# Altium project Inverter Processor.PrjPcb
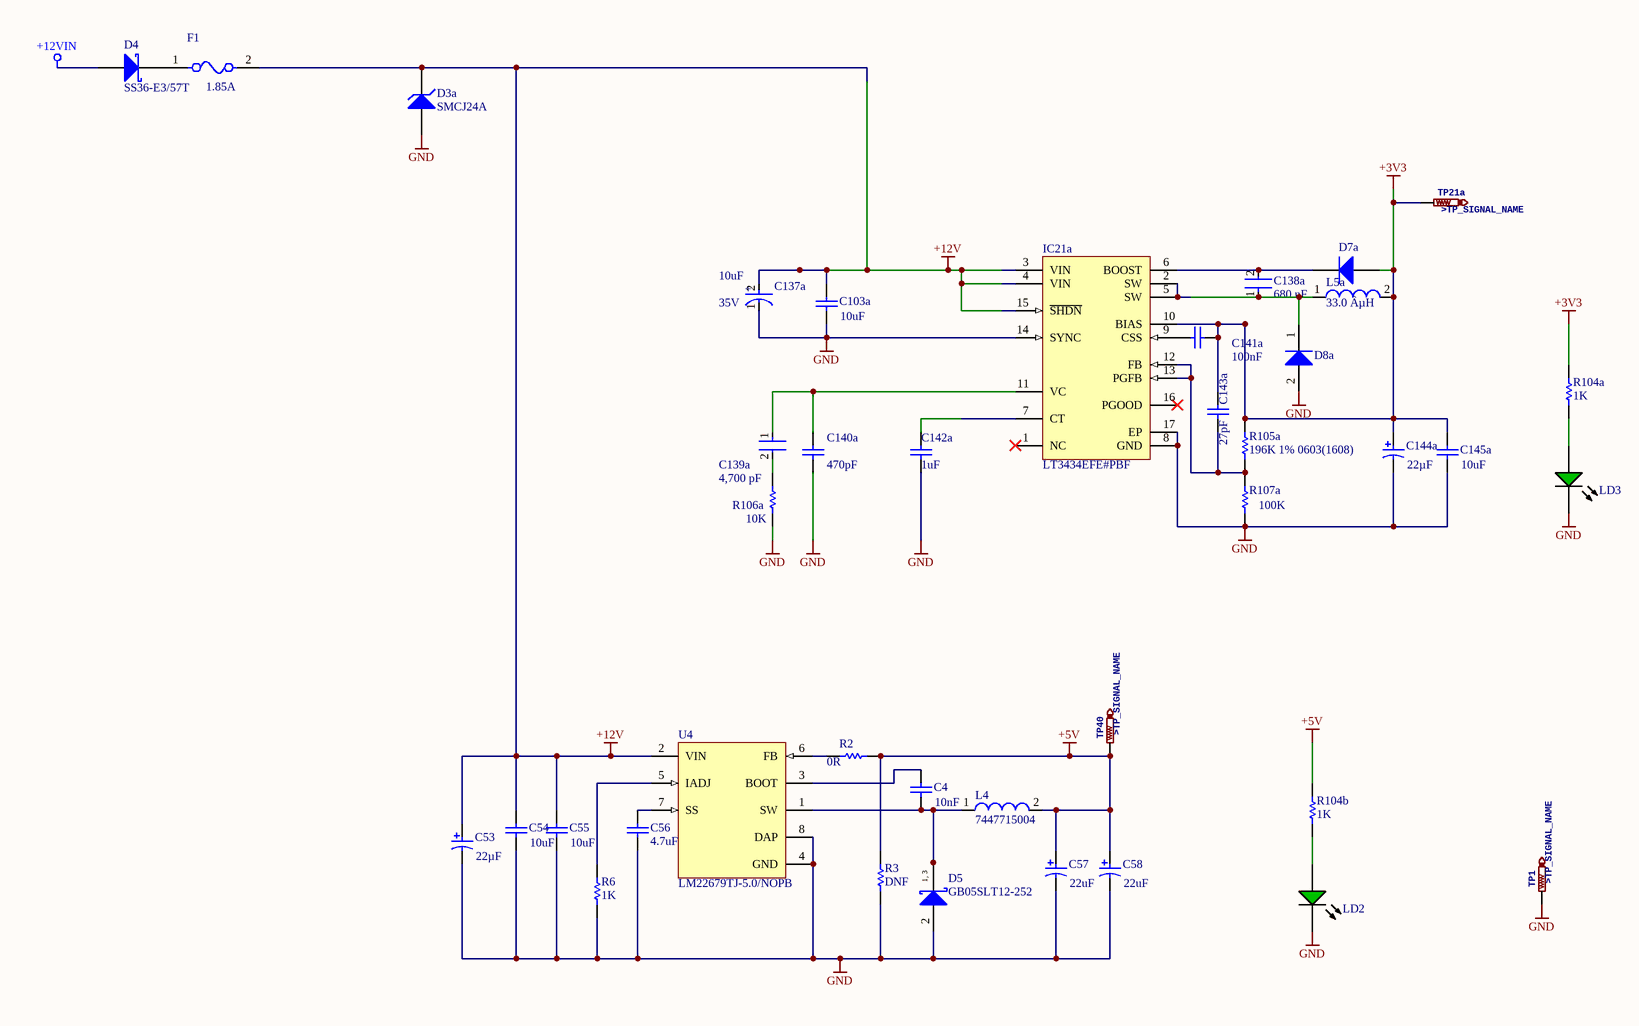
[diagram p0: Power.SchDoc]
1 sheet, 40 parts. Net scope: global (net labels, ports and power ports of the same name join across sheets).
Board file: Inverter Processor PCB.PcbDoc

## Sheet Power.SchDoc
size A3

### Parts
C4  value 10nF  [CAPC0805(2012)100_N]  (hidden comment: CAP 10nF 100V 0805(2012))
C53  Capacitance: 22µF  [CAPMP6032X28-T_V]  (hidden comment: TPSC226K025R0275)
C54  Capacitance: 10uF  [CAPC3225X280X20LL40]  (hidden comment: CGA6P3X7S1H106K250AB)
C55  Capacitance: 10uF  [CAPC3225X280X20LL40]  (hidden comment: CGA6P3X7S1H106K250AB)
C56  value 4.7uF  [CAPC1206(3216)190_M]  (hidden comment: CAP 4.7uF 25V 1206(3216))
C57  Capacitance: 22uF  [CAPMP7344X43-T_V]  (hidden comment: TPSE227M016R0100)
C58  Capacitance: 22uF  [CAPMP7344X43-T_V]  (hidden comment: TPSE227M016R0100)
C103a  Capacitance: 10uF  [CAPC3225X280X20LL40]  (hidden comment: CGA6P3X7S1H106K250AB)
C137a  value 10uF  Voltage Rating: 35V  [FP-TAJD-MFG]  (hidden comment: TAJD106M035RNJ)
C138a  value 680 nF  [FP-CC0603-DA-MFG]  (hidden comment: CC0603KRX7R7BB684)
C139a  value 4,700 pF  [FP-C0603C-CF-MFG]  (hidden comment: C0603C472G5GACTU)
C140a  value 470pF  [CAPC0603(1608)100_M]  (hidden comment: CAP 470pF 50V 0603(1608))
C141a  value 100nF  [CAPC0805(2012)100_L]  (hidden comment: CAP 100nF 16V 0805(2012))
C142a  value 1uF  [CAPC0805(2012)145_N]  (hidden comment: CAP 1uF 6.3V 0805(2012))
C143a  value 27pF  [CAPC0603(1608)100_L]  (hidden comment: CAP 27pF 50V 0603(1608))
C144a  Capacitance: 22µF  [CAPMP6032X28-T_V]  (hidden comment: TPSC226K025R0275)
C145a  Capacitance: 10uF  [CAPC3225X280X20LL40]  (hidden comment: CGA6P3X7S1H106K250AB)
D3a  SMCJ24A  [FAIR-DO-214AB-2_V]
D4  SS36-E3/57T  [VISH-DO-214AB-2_V]
D5  GB05SLT12-252  [GESC-TO-252-3_M]
D7a  JANTX1N4148-1  [MCSM-DO-35-2]  (value not drawn)
D8a  MBRS3201T3G  [ONSC-SMC-2-403-03_V]  (value not drawn)
F1  Hold Current: 1.85A  [FP-MF-LSMF-MFG]  (hidden comment: MF-LSMF185/33X-2)
IC21a  LT3434EFE#PBF  [LT-FE-16-EPV-BC_M]
L4  7447715004  [WE-PD-LS]
L5a  Inductance: 33.0 ÂµH  [WE-PD-LS]  (hidden comment: 7447715330)
LD2  SML-LXT0805GW-TR  [LUMX-SML-LXT0805_V]  (value not drawn)
LD3  SML-LXT0805GW-TR  [LUMX-SML-LXT0805_V]  (value not drawn)
R2  0R  [RESC1206(3216)_N]
R3  DNF  [RESC1206(3216)_N]
R6  1K  [RESC1206(3216)_N]
R104a  value 1K  [RESC0805(2012)_M]  (hidden comment: 1K 1% 0805(2012))
R104b  value 1K  [RESC0805(2012)_M]  (hidden comment: 1K 1% 0805(2012))
R105a  196K 1% 0603(1608)  [RESC0603(1608)_L]
R106a  value 10K  [RESC0805(2012)_L]  (hidden comment: 10K 5% 0805(2012))
R107a  Resistance: 100K  [RESC1608X55X25ML10T15]  (hidden comment: RC0603FR-07100KL)
TP1  TP_SIGNAL_NAME: >TP_SIGNAL_NAME  [P1-13]  (hidden comment: PTR1PAD1-13)
TP21a  TP_SIGNAL_NAME: >TP_SIGNAL_NAME  [P1-13]  (hidden comment: PTR1PAD1-13)
TP40  TP_SIGNAL_NAME: >TP_SIGNAL_NAME  [P1-13]  (hidden comment: PTR1PAD1-13)
U4  LM22679TJ-5.0/NOPB  [NDR0007A_L]

### Nets
+3V3: C141a.2 C143a.2 C144a.1 C145a.2 D7a.1(A) IC21a.10(BIAS) L5a.2 R104a.2 R105a.1 TP21a.TP
+5V: C57.1 C58.1 L4.2 R2.2 R3.2 R104b.2 TP40.TP
+12V: C53.1 C54.2 C55.2 C103a.2 C137a.2(A) D3a.2(K) F1.2 IC21a.3(VIN) IC21a.4(VIN) IC21a.15(~{SHDN}) U4.2(VIN)
+12VIN: D4.1(A)
GND: C53.2 C54.1 C55.1 C56.1 C57.2 C58.2 C103a.1 C137a.1(C) C140a.1 C142a.1 C144a.2 C145a.1 D3a.1(A) D5.2(A) D8a.2(A) IC21a.8(GND) IC21a.14(SYNC) IC21a.17(EP) LD2.2(K) LD3.2(K) R3.1 R6.1 R106a.1 R107a.1 TP1.TP U4.4(GND) U4.8(DAP)
NetC4_1: C4.1 D5.1(K) D5.3(K) L4.1 U4.1(SW)
NetC4_2: C4.2 U4.3(BOOT)
NetC56_2: C56.2 U4.7(SS)
NetC138a_1: C138a.1 D8a.1(K) IC21a.2(SW) IC21a.5(SW) L5a.1
NetC138a_2: C138a.2 D7a.2(K) IC21a.6(BOOST)
NetC139a_1: C139a.1 C140a.2 IC21a.11(VC)
NetC139a_2: C139a.2 R106a.2
NetC141a_1: C141a.1 IC21a.9(CSS)
NetC142a_2: C142a.2 IC21a.7(CT)
NetC143a_1: C143a.1 IC21a.12(FB) IC21a.13(PGFB) R105a.2 R107a.2
NetD4_2: D4.2(K) F1.1
NetLD2_1: LD2.1(A) R104b.1
NetLD3_1: LD3.1(A) R104a.1
NetR2_1: R2.1 U4.6(FB)
NetR6_2: R6.2 U4.5(IADJ)

Not connected (* = marked no-connect by the designer): IC21a 1(NC)* 16(PGOOD)*

### Notes on the sheet
- (in symbol CMP-2000-05145-1) 1, 3
- (in symbol CMP-04424-000020-1) +

### Library data of the parts
C4 = CMP-1036-03852-1: CAP 10nF 100V ±5% 0805 (2012 Metric) Thickness 1mm SMD; Tolerance: Â±5%; Case-Metric: 2012; Case-EIA: 0805; Max Thickness: 1 mm; Rated Voltage: 100 V; Technology: SMT
C53 C144a = CMP-2000-07295-1: Low ESR, 22 uF, 25 V, +/- 10%, -55 to 125 degC, 2-Pin SMD, RoHS, Tape and Reel; Manufacturer Size Code: C; Manufacturer: AVX; Voltage - Rated: 25V; Online Catalog: TPSSeries; Product Training Modules: ComponentSolutionsforSmartMeterApplications; ESR (Equivalent Series Resistance): 275mOhm; Featured Product: TPSCapacitors; Other Names: 478-3102-6; Type: Molded; Package / Case: 2312(6032Metric); Lifetime @ Temp.: -; Series: TPS; Datasheet Version: 01/2017; Tolerance: ±10%; Datasheet URL: http://datasheets.avx.com/TPS.pdf; Features: GeneralPurpose; Package Reference: CAPMP06032X28-T; Category: Capacitors; Operating Temperature: -55°C~125°C; Manufacturer URL: http://www.avx.com/; Mounting Technology: SurfaceMount; Package URL: http://www.avx.com/download/software/literature/AVX-Footprint-Library.pdf; Mounting Type: SurfaceMount; Packaging: Digi-Reel®; Package Description: 2-Pin Surface Mount Device, Body 6 x 3.25 mm; Family: TantalumCapacitors; Standard Package: 1; Lead Spacing: -
C54 C55 C103a C145a = CMP-2000-07444-1: Chip Capacitor, 10 uF, +/- 10%, 50 V, -55 to 125 degC, 1210 (3225 Metric), RoHS, Tape and Reel; Manufacturer: TDK; Voltage: 50V; Dielectric: X7S; Case Code (Imperial): 1210; RoHSCompliant: True; Mounting Technology: SurfaceMount; Datasheet Version: 12/2014; Case Code (Metric): 3225; Min Operating Temperature: -55degC; Package Quantity: 1; Case/Package: 1210; Length: 3.2mm; Width: 0.098inch; Termination: SMD/SMT; Lead Free: LeadFree; REACH SVHC: NoSVHC; Height: 2.5mm; Package Description: 2-Pin Surface Mount Device, Body 3.2 x 2.5 mm; Max Operating Temperature: 125degC; Datasheet URL: https://product.tdk.com/info/en/catalog/datasheets/mlcc_automotive_general_en.pdf; Weight: 0.000564oz; Voltage Rating: 50V; Depth: 2.5mm; Thickness: 0.11inch; Package Reference: 1210; Manufacturer URL: http://www.tdk.com/; Voltage Rating (DC): 50V; Tolerance: 10%; Packaging: TapeandReel; Composition: Ceramic
C56 = CMP-1037-04919-1: CAP 4.7uF 25V ±20% 1206 (3216 Metric) Thickness 1.9mm SMD; Tolerance: Â±20%; Case-Metric: 3216; Case-EIA: 1206; Max Thickness: 1.9 mm; Technology: SMT; Rated Voltage: 25 V
C57 C58 = CMP-2000-07312-1: Low ESR, 220 uF, 16 V, +/- 20%, -55 to 125 degC, 2-Pin SMD, RoHS, Tape and Reel; Manufacturer: AVX; Lead Spacing (nom): NotRequiredmm; Seal: NotRequired; Product Depth (mm): 4.3mm; DELETED: Compliant; Rad Hardened: No; Voltage: 16VDC; Product Height (mm): 4.1mm; Product Length (mm): 7.3mm; DCL: 35.2uA; ESR: 0.1ohm; DF: 10%; Case Style: Molded; Polarity: Polar; Package / Case: 7343-43; Failure Rate: NotRequired; Case Code: E; Length W/Weld (max): NotRequiredmm; Operating Temp Range: -55Cto125C; Length W/Weld: NotRequiredmm; Insulation: NotRequired; Packaging: TapeandReel; Construction: SMTChip; Tolerance (+ or -): 20%; Manufacturer URL: http://www.avx.com/; Wire Form: NotRequired; Mounting Style: SurfaceMount; Datasheet Version: 01/2017; Package URL: http://www.avx.com/download/software/literature/AVX-Footprint-Library.pdf; Mounting Technology: SurfaceMount; Datasheet URL: http://datasheets.avx.com/TPS.pdf; Package Description: 2-Pin Surface Mount Device, Body 7.3 x 4.35 mm; Product Diameter (mm): NotRequiredmm; Package Reference: CAPMP7344X43-T; Seated Plane Height: NotRequiredmm
C137a = CMP-04424-000020-1: CAP TANT 10UF 20% 35V 2917; Manufacturer: AVX; Life: 1000Hours; Esr: 1Ω; Leakage Current: 3.5uA; Material: Tantalum; Dissipation Factor: 6%; Package: TAJD; Lead Free: Yes; Capacitance: 10uF; Device Class L3: Tantalum Capacitors; Digikey Description: CAP TANT 10UF 20% 35V 2917; ComponentLink2URL: http://datasheets.avx.com/TAJ.pdf; Device Class L1: Passive Components; Device Class L2: Capacitors; Category: Cap; Mouser Description: Cap Tant Solid 10uF 35V D CASE 20% (7.3 X 4.3 X 2.9mm) Inward L SMD 7343-31 1 Ohm 125C T/R; Octopart: https://octopart.com/tajd106m035rnj-avx-3819655; ComponentLink2Description: Datasheet; Footprint Url: http://www.avx.com/download/software/literature/AVX-Footprint-Library.pdf; Temperature Range High: +125°C; Automotive: No; Height: 3.1mm; RoHS: TRUE; Manufacturer Part Number: TAJD106M035RNJ; Temperature: -55°C to +125°C; Tolerance: 20%; Temperature Range Low: -55°C
C138a = CMP-03422-000082-1: CAP CER 0.68UF 16V X7R 0603; Manufacturer: YAGEO; Tolerance: 0.1; Temperature Coefficient: 15%; Material: Ceramic; Device Class L3: Ceramic Capacitors; Digikey Description: CAP CER 0.68UF 16V X7R 0603; RoHS: TRUE; Footprint Url: http://www.yageo.com/exep/pages/download/literatures/UPY-C_GEN_24.pdf; ComponentLink2URL: http://www.yageo.com/documents/recent/UPY-GPHC_X7R_6.3V-to-50V_18.pdf; Device Class L1: Passive Components; Temperature Range Low: -55°C; Category: Cap; Mouser Description: 0603 16 V 680 nF X7R ±10% Tolerance Multilayer Ceramic Capacitor; ComponentLink2Description: Datasheet; Temperature Range High: +125°C; Capacitance: 680 nF; Temperature: -55°C to +125°C; Voltage: 16 V; Manufacturer Part Number: CC0603KRX7R7BB684; Automotive: No; Device Class L2: Capacitors; Height: 0.9mm; Lead Free: Yes; Package: CC0603-DA; Temperature Characteristic: X7R; Voltage Rating: 16 V; Octopart: https://octopart.com/cc0603krx7r7bb684-yageo-21707056
C139a = CMP-03020-006967-1: CAP CER 4700PF 50V NP0 0603; Manufacturer: KEMET; Temperature Characteristic: C0G; Tolerance: 0.02; Temperature Coefficient: 30ppm/°C; Automotive Grade: Grade 1; Material: Ceramic; Package: C0603C-CF; Mouser Description: Multilayer Ceramic Capacitors MLCC - SMD/SMT 50volts 4700pF 2% C0G; Lead Free: Yes; Voltage Rating: 50 V; Octopart: https://octopart.com/c0603c472g5gactu-kemet-19050074; ComponentLink2Description: Datasheet; RoHS: TRUE; Category: Cap; Manufacturer Part Number: C0603C472G5GACTU; Capacitance: 4,700 pF; Device Class L3: Ceramic Capacitors; ComponentLink2URL: https://api.kemet.com/component-edge/download/datasheet/C0603C100J5GACAUTO.pdf; Temperature Range Low: -55°C; Temperature: -55°C to +125°C; Device Class L2: Capacitors; Device Class L1: Passive Components; Automotive: Yes; Height: 0.87mm; Temperature Range High: +125°C; Digikey Description: CAP CER 4700PF 50V NP0 0603
C140a = CMP-1035-01675-1: CAP 470pF 50V ±5% 0603 (1608 Metric) Thickness 1mm SMD; Case-Metric: 1608; Tolerance: Â±5%; Case-EIA: 0603; Technology: SMT; Rated Voltage: 50 V; Max Thickness: 1 mm
C141a = CMP-1036-04400-1: CAP 100nF 16V ±5% 0805 (2012 Metric) Thickness 1mm SMD; Case-EIA: 0805; Tolerance: Â±5%; Case-Metric: 2012; Max Thickness: 1 mm; Technology: SMT; Rated Voltage: 16 V
C142a = CMP-1036-04731-1: CAP 1uF 6.3V ±10% 0805 (2012 Metric) Thickness 1.45mm SMD; Case-Metric: 2012; Case-EIA: 0805; Tolerance: Â±10%; Max Thickness: 1.45 mm; Technology: SMT; Rated Voltage: 6.3 V
C143a = CMP-1035-00889-1: CAP 27pF 50V ±10% 0603 (1608 Metric) Thickness 1mm SMD; Case-EIA: 0603; Tolerance: Â±10%; Case-Metric: 1608; Technology: SMT; Rated Voltage: 50 V; Max Thickness: 1 mm
D3a = CMP-2000-07104-1: Transient Voltage Suppressor, 1500 W, 24 V, 2-Pin SMD, RoHS, Tape and Reel; Manufacturer: FairchildSemiconductor; Peak Pulse Power Dissipation: 1500W; Test Current: 1mA; Maximum Reverse Leakage Current: 5uA; Direction Type: Uni-Directional; Configuration: Single; Maximum Peak Pulse Current: 38.6A; Minimum Breakdown Voltage: 26.7V; Maximum Reverse Stand-off Voltage: 24V; Rad Hard: No; Maximum Clamping Voltage: 38.9V; Datasheet Version: Rev. 5.7, 09/2015; Category: TVS; Datasheet URL: https://www.fairchildsemi.com/datasheets/SM/SMCJ24A.pdf; Packaging: Tape&Reel; Package Reference: DO-214AB; Mounting Technology: SurfaceMount; Manufacturer URL: https://www.fairchildsemi.com/; Operating Temperature: -55to150°C; Package: 2DO-214AB; Package Description: 2-Pin Surface Mount Device, Body 6.875 x 5.9 mm; Mounting: SurfaceMount
D4 = CMP-2000-07150-1: Surface Mount Schottky Barrier Rectifier, 60 V, 3 A, -55 to 150 degC, 2-Pin SMC (DO-214AB), RoHS, Tape and Reel; Manufacturer: Vishay; Forward Current If(AV): 3A; Diode Configuration: Single; Forward Surge Current Ifsm Max: 100A; SVHC: ToBeAdvised; No. of Pins: 2Pins; Forward Voltage VF Max: 750mV; Repetitive Reverse Voltage Vrrm Max: 60V; Datasheet URL: http://www.vishay.com/docs/88751/ss32.pdf; Datasheet Version: 08/2015; Manufacturer URL: http://www.vishay.com/; Diode Type: Schottky; Package Reference: DO-214AB; Mounting Technology: SurfaceMount; Diode Case Style: DO-214AB; Package Description: 2-Pin Surface Mount Device, Body 6.855 x 5.905 mm; Packaging: CutTape; Operating Temperature Max: 150°C; Product Range: -
D5 = CMP-2000-05145-1: Silicon Carbide Power Schottky Diode, 5 A, -55 to 175 degC, 3-Pin TO-252, RoHS, Bulk; Manufacturer: GeneSiC Semiconductor; SVHC: NoSVHC(16-Jun-2014); Diode Configuration: Single; Continuous Forward Current If: 5A; Total Capacitive Charge Qc: 35nC; Product Range: GENESICSEMICONDUCTOR-1200VSeries; Repetitive Reverse Voltage Vrrm Max: 1.2kV; No. of Pins: 3; Datasheet URL: http://www.genesicsemi.com/images/products_sic/rectifiers/GB05SLT12-252.pdf; Operating Temperature Min: -55degC; Manufacturer URL: http://www.genesicsemi.com/; Datasheet Version: Rev. 3, 08/2014; MSL: MSL1-Unlimited; Packaging: Each; Diode Case Style: TO-252; Junction Temperature, Tj max: 175degC
D7a = CMP-2000-06494-1: Glass Axial Switching Diode, 200 mA, 100 V, 2-Pin DO-35, RoHS, Bulk; Manufacturer: Microsemi; Peak Average Forward Current: 0.2A; Peak Reverse Recovery Time: 5ns; Rad Hard: No; Configuration: Single; Peak Forward Voltage: 1.2@0.1AV; Peak Reverse Repetitive Voltage: 75V; Breakdown Voltage: 100V; Peak Reverse Current: 0.5uA; Operating Temperature: -65to200°C; Package Description: 2-Pin Axial Lead, Dia 1.665 mm, Body Length 4.065 mm; PartNumber: 1N4148-1; Type: SwitchingDiode; Package: 2DO-35; Output Current: 0.2A; Mounting: ThroughHole; Mounting Technology: ThroughHole; Packaging: Bulk; Datasheet Version: Rev. 1, 11/2012; Manufacturer URL: http://www.microsemi.com/; Package Reference: DO-35-2; Datasheet URL: http://www.microsemi.com/document-portal/doc_download/125211-lds-0281
D8a = CMP-1055-00379-1: 200 V, 3 A Schottky Fast Soft-Recovery Power Rectifier, 2-Pin SMC, Pb-Free, Tape and Reel; Manufacturer: On Semiconductor; Configuration: Single; trr Max (ns): 35; IFSM Max (A): 100; PackageDescription: 2-Pin Small Molded Package, J-Bend Lead, Body 5.845 x 6.855 mm; ComponentLink2URL: http://www.onsemi.cn/pub_link/Collateral/MBRS3201T3-D.PDF; Packing: Tape and Reel; DatasheetVersion: Rev. 3; PartNumber: MBRS3201T3G; ComponentLink2Description: Datasheet; ComponentLink1URL: http://www.onsemi.com/; PackageVersion: Rev. E, 08/2005; PackageReference: SMC-2-403-03; ComponentLink1Description: Manufacturer URL; RoHS: TRUE; ComponentLink3Description: Package Specification; ComponentLink3URL: http://www.onsemi.com/pub_link/Collateral/403-03.PDF; Mounting Technology: Surface Mount
F1 = CMP-07400-000015-1: PTC RESET FUSE 33V 1.85A 2920; Manufacturer: Bourns; Current Rating: 40A; Automotive Grade: Grade 3; Resistance: 0.045-0.15Ω; Value: 0.045-0.15Ω; Trip Current: 3.7A; Trip Time: 2.5s; Manufacturer Part Number: MF-LSMF185/33X-2; Category: Fuse; Octopart: https://octopart.com/mf-lsmf185%2F33x-2-bourns-19504849; RoHS: TRUE; Digikey Description: PTC RESET FUSE 33V 1.85A 2920; Lead Free: Yes; Voltage Rating: 33V; ComponentLink2URL: https://www.bourns.com/docs/Product-Datasheets/mflsmf.pdf; Package: MF-LSMF; ComponentLink2Description: Datasheet; Mouser Description: Resettable Fuses - PPTC 1.85A 33V 0.045ohm SMD 2920; Device Class L2: PTC Resettable Fuses; Temperature Range High: +85°C; Temperature Range Low: -40°C; Device Class L1: Circuit Protection; Device Class L3: unset; Height: 1.6mm; Automotive: Yes; Temperature: -40°C to +85°C
IC21a = CMP-0491-00607-1: High Voltage 3 A, 200 kHz Step-Down Switching Regulator with 100 uA Quiescent Current, 16-pin SOP (FE-16-EPV-BC), -40 to 125 degC, Pb-Free; Manufacturer: Linear Technology; Frequency Sync Range: 230kHz - 500kHz; Number of Outputs: 1; Mounting Technology: Surface Mount; DatasheetVersion: Rev. B; ComponentLink3Description: Package Specification; ComponentLink1URL: http://www.linear.com/; PackageDescription: 16-Pin Plastic TSSOP, Body 5 x 4.4 mm, Pitch 0.65 mm; ComponentLink2Description: Datasheet; ComponentLink1Description: Manufacturer URL; ComponentLink2URL: http://cds.linear.com/docs/en/datasheet/3434fb.pdf; PartNumber: LT3434EFE#PBF; ComponentLink3URL: http://cds.linear.com/docs/en/packaging/05081663__J_FE16(BC).pdf; PackageReference: FE-16; PackageVersion: Rev. J, 11/2012; RoHS: TRUE
L4 = CMP-0227-00142-1: SMD-Shielded Power Inductor WE-PD, L = 4.70 µH; Inductance: 4.70 ÂµH; PackageReference: WE-PD-LS; ComponentLink2Description: Datasheet; ComponentLink2URL: http://www.we-online.de/katalog/media/pdf/7447715004.pdf; DatasheetVersion: ver 1, Nov-2008; ComponentLink1URL: http://www.we-online.com; PackageVersion: 2008; PackageDescription: SMD Inductor, 2-Leads, Body 12.0 x 12.0 mm; ComponentLink1Description: Manufacturer Link
L5a = CMP-0227-00710-1: SMD-Shielded Power Inductor WE-PD, L = 33.0 µH; PackageDescription: SMD Inductor, 2-Leads, Body 12.0 x 12.0 mm; ComponentLink2URL: http://www.we-online.de/katalog/media/pdf/7447715330.pdf; ComponentLink2Description: Datasheet; PackageVersion: 2008; ComponentLink1Description: Manufacturer Link; ComponentLink1URL: http://www.we-online.com; DatasheetVersion: ver 1, Nov-2008; PackageReference: WE-PD-LS
LD2 LD3 = CMP-1724-00001-1: LED, GREEN, 565 nm, 2 V, -25 to 80 degC, 2-Pin SMD, RoHS, Tape and Reel; Case\/Package: 0805; RoHSCompliant: true; REACH SVHC: No SVHC; Packaging: Tape and Reel; ComponentLink2URL: http://www.lumex.com/content/files/ProductAttachment/SML-LXT0805GW-TR.pdf; ComponentLink1URL: http://www.lumexinstruments.com/; Min Operating Temperature: -25 degC; Max Operating Temperature: 85 degC; DatasheetVersion: Rev. F, 09/2009; Case Code (Metric): 2012; Width: 1.25 mm; PackageDescription: 2-Pin Surface Mount Device, Body 2 x 1.25 mm; ComponentLink1Description: Manufacturer URL; Mount: Surface Mount; PackageReference: SML-LXT0805; Length: 2 mm; Case Code (Imperial): 0805; ComponentLink2Description: Datasheet; Package Quantity: 4000; Mounting Technology: Surface Mount
R2 R3 R6 = CMP-1014-00510-1: 1K 0.25W 1% 1206 (3216 Metric)  SMD; Case-Metric: 3216; Case-EIA: 1206; Value: 1000.00 Ohm; Power: 0.25 W; Tolerance: 1 %; Technology: SMT
R104a R104b = CMP-1013-00510-1: 1K 0.125W 1% 0805 (2012 Metric)  SMD; Case-Metric: 2012; Case-EIA: 0805; Tolerance: 1 %; Power: 0.125 W; Technology: SMT
R105a = CMP-1012-00767-1: 196K 0.1W 1% 0603 (1608 Metric)  SMD; Case-EIA: 0603; Value: 196000.00 Ohm; Case-Metric: 1608; Power: 0.1 W; Tolerance: 1 %; Technology: SMT
R106a = CMP-1013-00098-1: 10K 0.125W 5% 0805 (2012 Metric)  SMD; Case-Metric: 2012; Case-EIA: 0805; Tolerance: 5 %; Power: 0.125 W; Technology: SMT
R107a = CMP-2100-03662-1: Chip Resistor, 100 KOhm, +/- 1%, 0.1 W, -55 to 155 degC, 0603 (1608 Metric), RoHS, Tape and Reel; Manufacturer: Yageo; Power Rating: 100mW; Voltage Rating: 50V; Temperature Coefficient: 100ppm/degreesC; Datasheet Version: Rev. 5, 10/2016; Height: 0.45mm; Lead Free: LeadFree; Manufacturer URL: http://www.yageo.com/; Package Reference: 0603; Depth: 0.8mm; RoHSCompliant: true; Composition: ThickFilm; Military Standard: Not; Case/Package: 0603; Packaging: TapeandReel; Case Code (Imperial): 0603; Voltage Rating (DC): 50V; Case Code (Metric): 1608; Tolerance: 1%; Termination: SMD/SMT; Min Operating Temperature: -55degC; Number of Pins: 2; Length: 1.6mm; Width: 0.8mm; Datasheet URL: http://www.yageo.com/NewPortal/yageodocoutput?fileName=/pdf/R-Chip/PYu-RC_Group_51_RoHS_L_5.pdf; Package Description: 2-Pin Surface Mount Device, Body 1.6 x 0.8 mm; Max Operating Temperature: 155degC; REACH SVHC: NoSVHC
TP1 TP21a TP40 = PTR1PAD1-13: TEST PIN
U4 = CMP-0069-00298-3: 5A SIMPLE SWITCHER®, Step-Down Voltage Regulator with Adjustable Soft-Start and Current Limit, 7-pin TO-263 Thin, Pb-Free; Manufacturer: Texas Instruments; PowerWise: N; PackageTopMarking: NSUZXYTTE#*LM22679*TJ-5.0; PinCount: 7; ComponentLink1URL: http://www.ti.com/general/docs/lit/getliterature.tsp?genericPartNumber=LM22679&fileType=pdf; CompType: Switcher; ComponentLink1Description: Datasheet URL; RoHS: Y; PackageReference: NDR0007A; PackageDescription: Thin TO-263, Molded, 9.85 x 10.16 x 2mm Body, 7 Lead, 1.27mm Pitch, Surface Mount